# EAGLE design alt_signal_pins (EAGLE 5.11)
ABBREV: jn6; PROJECT: JeeNode v6
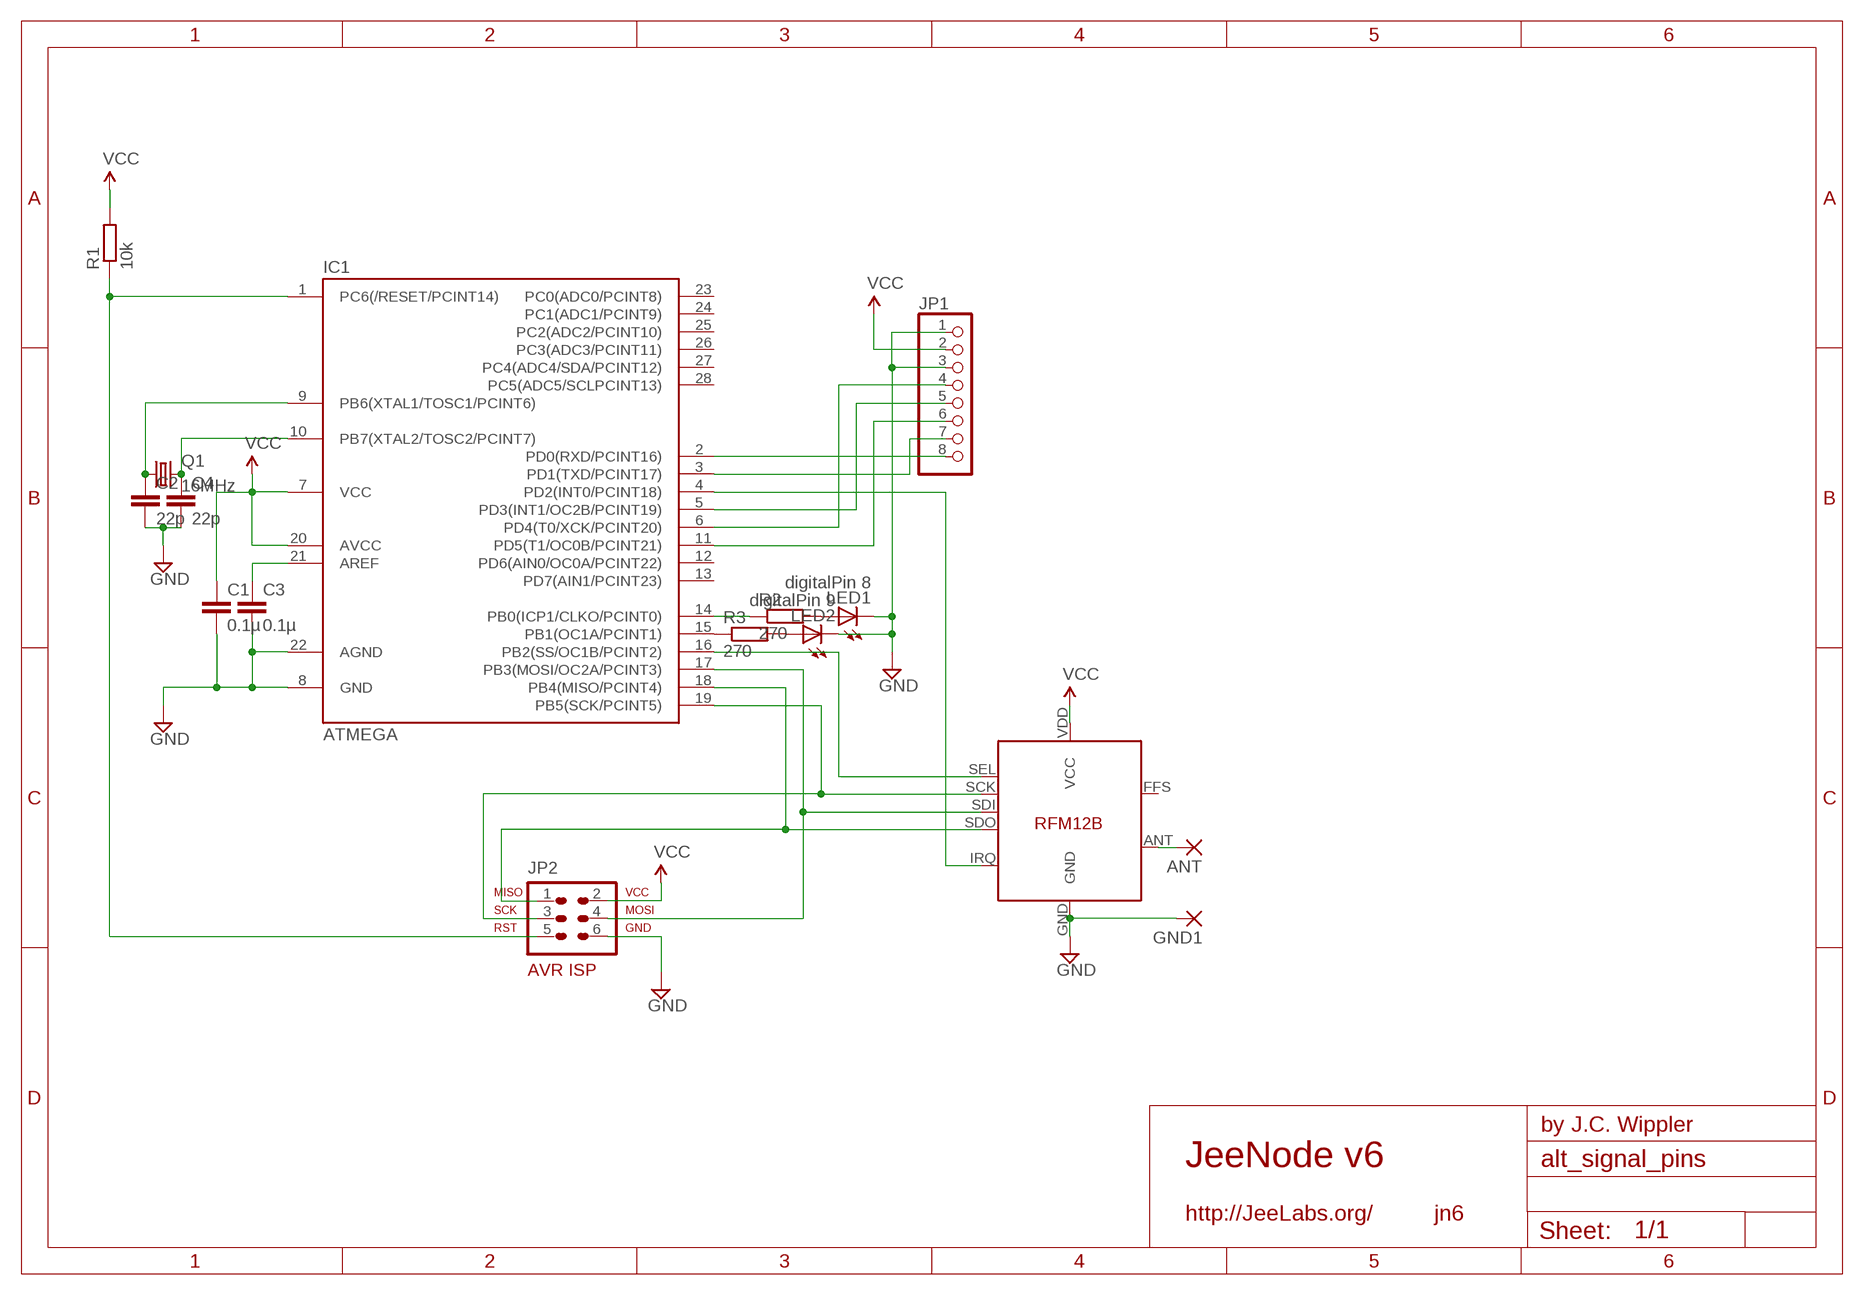
[diagram p0: schematic, sheet 1]

## Parts
ANT  1,6/0,8  [1,6/0,8]
C1  0.1µ  C-EU025-024X044  [C025-024X044]
C2  22p  C-EU025-024X044  [C025-024X044]
C3  0.1µ  C-EU025-024X044  [C025-024X044]
C4  22p  C-EU025-024X044  [C025-024X044]
GND1  1,6/0,8  [1,6/0,8]
IC1  ATMEGA  ATMEGA48/88/168-PU  [DIL28-3]
JP1  PINHD-1X8/90  [1X08/90]
JP2  AVR-ISP-6HORZ  [AVR-ISP-6R]
LED1  digitalPin 8  LED3MM  [LED3MM]
LED2  digitalPin 9  LED3MM  [LED3MM]
Q1  16MHz  CRYSTALHC49U70  [HC49U70]
R1  10k  R-EU_0204/7  [0204/7]
R2  270  R-EU_0204/7  [0204/7]
R3  270  R-EU_0204/7  [0204/7]
U$1  RFM12B  [RFM12B]

## Nets
GND [power]: C1.2 C2.2 C3.2 C4.2 GND1.1(P) IC1.8(GND) IC1.22(AGND) JP1.1 JP1.3 JP2.6 LED1.K(C) LED2.K(C) U$1.GND
INPUT1/PD0: IC1.2(PD0(RXD/PCINT16)) JP1.8
INPUT2/PD1: IC1.3(PD1(TXD/PCINT17)) JP1.7
INPUT3/PD3: IC1.5(PD3(INT1/OC2B/PCINT19)) JP1.5
INPUT4/PD4: IC1.6(PD4(T0/XCK/PCINT20)) JP1.4
INPUT5/PD5: IC1.11(PD5(T1/OC0B/PCINT21)) JP1.6
IRQ/PD2: IC1.4(PD2(INT0/PCINT18)) U$1.IRQ
MISO/PB4: IC1.18(PB4(MISO/PCINT4)) JP2.1 U$1.SDO
MOSI/PB3: IC1.17(PB3(MOSI/OC2A/PCINT3)) JP2.4 U$1.SDI
N$1: C2.1 IC1.9(PB6(XTAL1/TOSC1/PCINT6)) Q1.1
N$6: IC1.14(PB0(ICP1/CLKO/PCINT0)) R2.1
N$13: ANT.1(P) U$1.ANT
N$14: IC1.15(PB1(OC1A/PCINT1)) R3.1
N$15: LED1.A R2.2
N$16: LED2.A R3.2
N$19: C3.1 IC1.21(AREF)
N$21: C4.1 IC1.10(PB7(XTAL2/TOSC2/PCINT7)) Q1.2
RST: IC1.1(PC6(/RESET/PCINT14)) JP2.5 R1.1
SCK/PB5: IC1.19(PB5(SCK/PCINT5)) JP2.3 U$1.SCK
SEL/PB2: IC1.16(PB2(SS/OC1B/PCINT2)) U$1.SEL
VCC [power]: C1.1 IC1.7(VCC) IC1.20(AVCC) JP1.2 JP2.2 R1.2 U$1.VDD(VCC)
Unconnected: IC1.12(PD6(AIN0/OC0A/PCINT22)) IC1.13(PD7(AIN1/PCINT23)) IC1.23(PC0(ADC0/PCINT8)) IC1.24(PC1(ADC1/PCINT9)) IC1.25(PC2(ADC2/PCINT10)) IC1.26(PC3(ADC3/PCINT11)) IC1.27(PC4(ADC4/SDA/PCINT12)) IC1.28(PC5(ADC5/SCLPCINT13)) U$1.FFS

## Library data of the parts
ANT GND1 = JeeLabs:1,6/0,8: THROUGH-HOLE PAD
C1-C4 = resistor:C-EU: CAPACITOR, European symbol
IC1 = atmega8:ATMEGA48/88/168-PU
JP1 = pinhead:PINHD-1X8: PIN HEADER
JP2 = avr-7:AVR-ISP-6: AVR ISP-6 Serial Programming Header
LED1 LED2 = led:LED: LED OSRAM: - CHIPLED LG R971, LG N971, LY N971, LG Q971, LY Q971, LO R971, LY R971 LH N974, LH R974 LS Q976, LO Q976, LY Q976 LO Q996 - Hyper CHIPLED LW Q18S LB Q993, LB Q99A, LB R99A - SideLED LS A670, LO A670, LY A670, LG A670, LP A670 LB A673, LV A673, LT A673, LW A673 LH A674 LY A675 LS A676, LA A676, LO A676, LY A676, LW A676 LS A679, LY A679, LG A679 - Hyper Micro SIDELED® LS Y876, LA Y876, LO Y876, LY Y876 LT Y87S - SmartLED LW L88C, LW L88S LB L89C, LB L89S, LG L890 LS L89K, LO L89K, LY L89K LS L896, LA L896, LO L896, LY L896 - TOPLED LS T670, LO T670, LY T670, LG T670, LP T670 LSG T670, LSP T670, LSY T670, LOP T670, LYG T670 LG T671, LOG T671, LSG T671 LB T673, LV T673, LT T673, LW T673 LH T674 LS T676, LA T676, LO T676, LY T676, LB T676, LH T676, LSB T676, LW T676 LB T67C, LV T67C, LT T67C, LS T67K, LO T67K, LY T67K, LW E67C LS E67B, LA E67B, LO E67B, LY E67B, LB E67C, LV E67C, LT E67C LW T67C LS T679, LY T679, LG T679 LS T770, LO T770, LY T770, LG T770, LP T770 LB T773, LV T773, LT T773, LW T773 LH T774 LS E675, LA E675, LY E675, LS T675 LS T776, LA T776, LO T776, LY T776, LB T776 LHGB T686 LT T68C, LB T68C - Hyper Mini TOPLED® LB M676 - Mini TOPLED Santana® LG M470 LS M47K, LO M47K, LY M47K Source: http://www.osram.convergy.de LUXEON: - LUMILED® LXK2-PW12-R00, LXK2-PW12-S00, LXK2-PW14-U00, LXK2-PW14-V00 LXK2-PM12-R00, LXK2-PM12-S00, LXK2-PM14-U00 LXK2-PE12-Q00, LXK2-PE12-R00, LXK2-PE12-S00, LXK2-PE14-T00, LXK2-PE14-U00 LXK2-PB12-K00, LXK2-PB12-L00, LXK2-PB12-M00, LXK2-PB14-N00, LXK2-PB14-P00, LXK2-PB14-Q00 LXK2-PR12-L00, LXK2-PR12-M00, LXK2-PR14-Q00, LXK2-PR14-R00 LXK2-PD12-Q00, LXK2-PD12-R00, LXK2-PD12-S00 LXK2-PH12-R00, LXK2-PH12-S00 LXK2-PL12-P00, LXK2-PL12-Q00, LXK2-PL12-R00 Source: www.luxeon.com KINGBRIGHT: KA-3528ASYC Source: www.kingbright.com
Q1 = crystal:CRYSTAL: CRYSTAL; OC_FARNELL: unknown; OC_NEWARK: unknown
R1 = resistor:R-EU_: RESISTOR, European symbol
R2 R3 = rcl:R-EU_: RESISTOR, European symbol
U$1 = JeeLabs:RFM12B

## Net classes
1 power: width 0.381 mm, clearance 0.254 mm

## Board
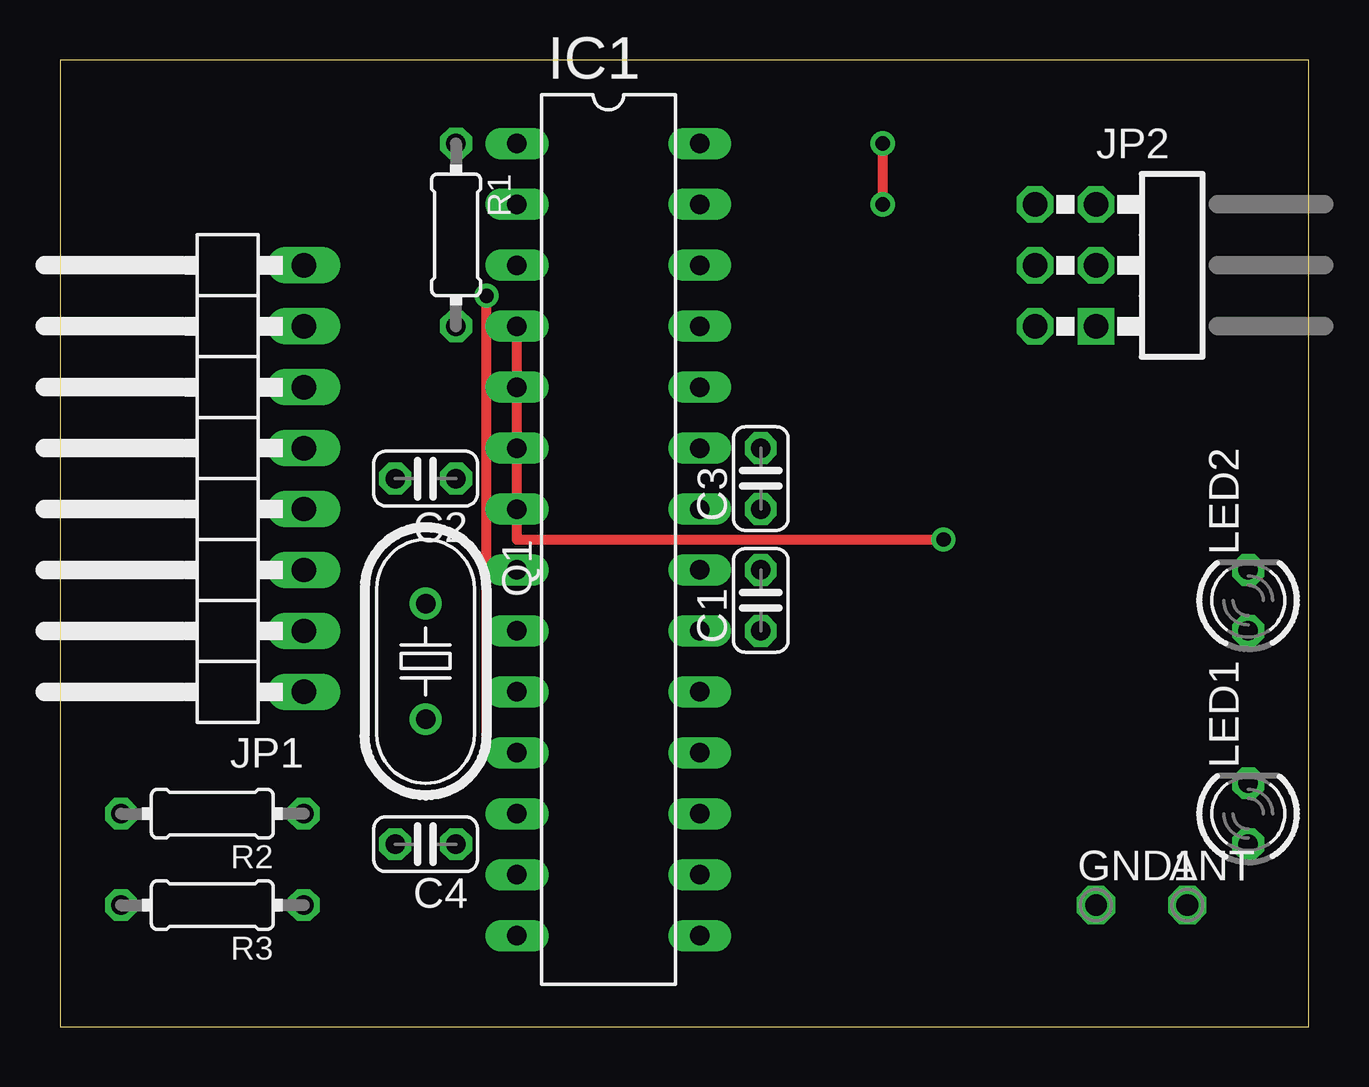
[diagram p1: board, top side]
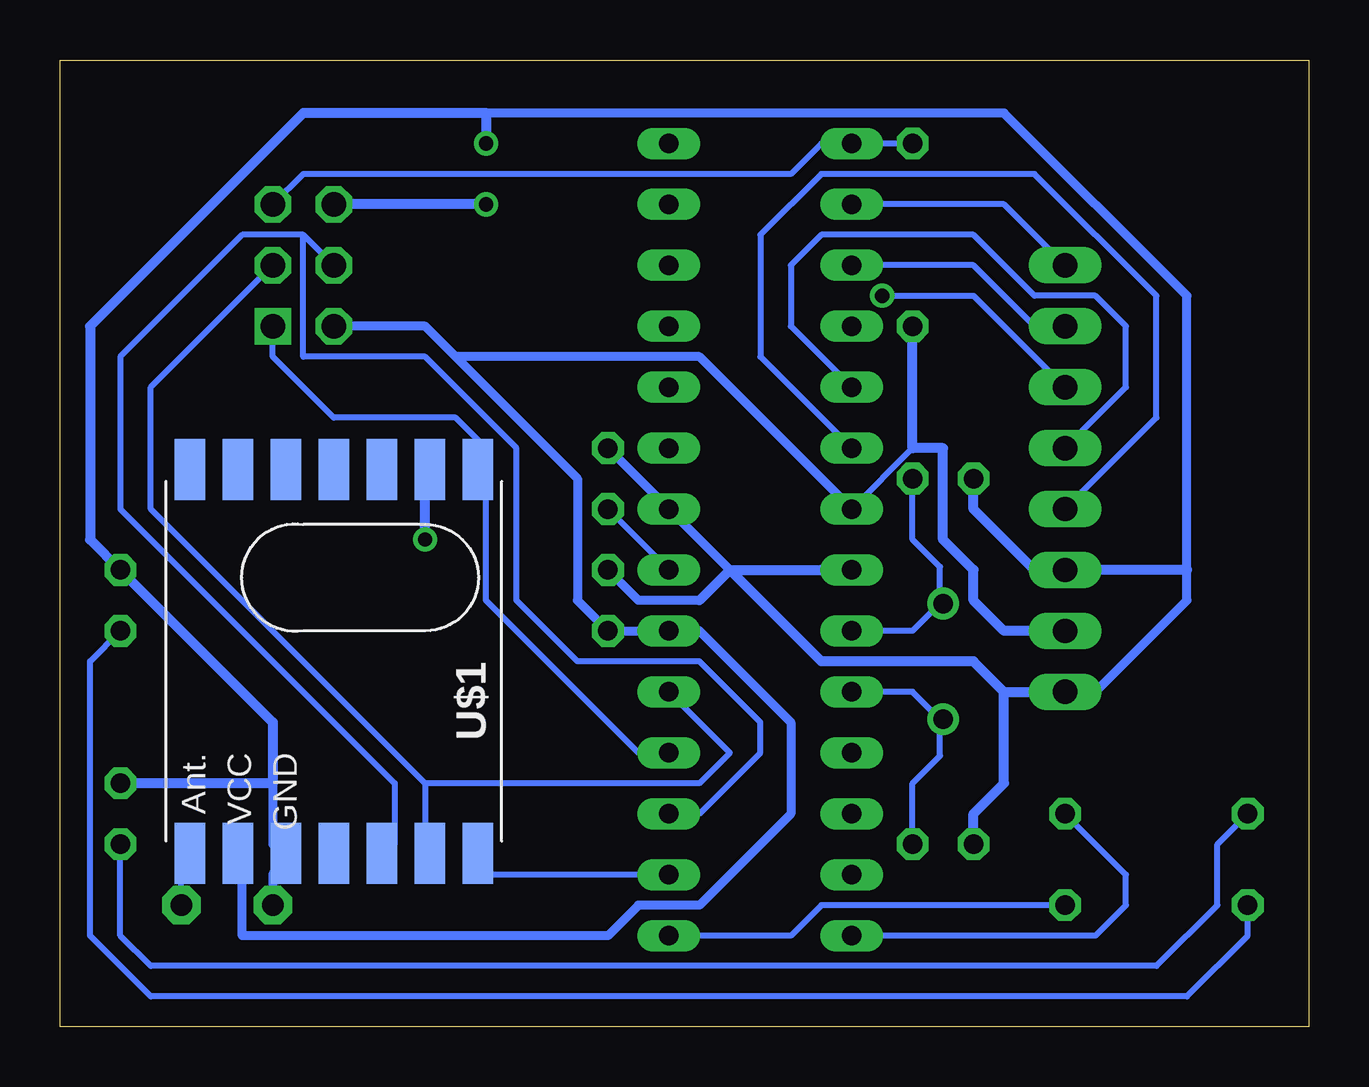
[diagram p2: board, bottom side, seen from below]

Size 52.05 x 40.31 mm. Coordinates in mm from the lower left corner, seen from the top.
Outline: 0,0 52.05,0 52.05,40.31 0,40.31 0,0
Copper layers (1*16): Top 0.035mm / dielectric 1.5mm / Bottom 0.035mm
Design rules "default": minimum track width 10mil, minimum drill 24mil, track to track 8mil, track to pad 8mil, pad to pad 8mil, via to via 8mil, smd to smd 8mil, copper to edge 40mil, drill to drill 8mil, minimum pad ring 10mil, minimum via ring 8mil, stop-mask expansion 4mil, vias tented up to drill 0mil, thermal gap 10mil

### Footprints (pad centres in the part's own frame; a part is rotated, then mirrored left to right if it is on the bottom)
1,6/0,8 = drill 0.9 pad 1.6 octagon: 1 0,0
C025-024X044 = drill 0.813 octagon: 1 -1.27,0; 2 1.27,0
DIL28-3 = drill 0.813 long: 1 -16.51,-3.81; 2 -13.97,-3.81; 3 -11.43,-3.81; 4 -8.89,-3.81; 5 -6.35,-3.81; 6 -3.81,-3.81; 7 -1.27,-3.81; 8 1.27,-3.81; 9 3.81,-3.81; 10 6.35,-3.81; 11 8.89,-3.81; 12 11.43,-3.81; 13 13.97,-3.81; 14 16.51,-3.81; 15 16.51,3.81; 16 13.97,3.81; 17 11.43,3.81; 18 8.89,3.81; 19 6.35,3.81; 20 3.81,3.81; 21 1.27,3.81; 22 -1.27,3.81; 23 -3.81,3.81; 24 -6.35,3.81; 25 -8.89,3.81; 26 -11.43,3.81; 27 -13.97,3.81; 28 -16.51,3.81
1X08/90 = drill 1.016 long: 1 -8.89,-3.81; 2 -6.35,-3.81; 3 -3.81,-3.81; 4 -1.27,-3.81; 5 1.27,-3.81; 6 3.81,-3.81; 7 6.35,-3.81; 8 8.89,-3.81
AVR-ISP-6R = drill 1.016 square: 1 -2.54,-1.27 | drill 1.016 octagon: 2 -2.54,1.27; 3 0,-1.27; 4 0,1.27; 5 2.54,-1.27; 6 2.54,1.27
LED3MM = drill 0.813 octagon: A -1.27,0; K 1.27,0
HC49U70 = drill 0.813 round: 1 -2.413,0; 2 2.413,0
0204/7 = drill 0.813 octagon: 1 -3.81,0; 2 3.81,0
RFM12B = smd 2.54 x 1.27: ANT 8,-6; FFS -8,2; GND 8,-2; IRQ -8,4; P$8 -8,0; P$9 -8,-2; P$10 -8,-4; P$12 -8,-6; P$16 8,0; SCK 8,4; SDI 8,2; SDO -8,6; SEL 8,6; VDD 8,-4

### Placement (x,y rotation side)
ANT  46.99,5.08 0 top
C1  29.21,17.78 90 top
C2  15.24,22.86 180 top
C3  29.21,22.86 90 top
C4  15.24,7.62 180 top
GND1  43.18,5.08 0 top
IC1  22.86,20.32 270 top
JP1  6.35,22.86 90 top
JP2  41.91,31.75 90 top
LED1  49.53,8.89 90 top
LED2  49.53,17.78 90 top
Q1  15.24,15.24 270 top
R1  16.51,33.02 270 top
R2  6.35,8.89 180 top
R3  6.35,5.08 180 top
U$1  40.64,15.24 270 bottom

### Tracks (layer width: path | path; a pad name or v marks a point on that pad's centre or on a via)
GND  (via drill 0.6)
  Top 0.406: v34.29,36.83 v34.29,34.29
  Bottom 0.381: 24.13,19.05 IC1.22 C3.2 | C1.2 27.94,17.78 25.4,17.78 | GND1.1 43.18,6.35 U$1.GND 43.18,7.62 43.18,10.16 | 8.89,13.97 5.08,17.78 5.08,19.05 5.08,30.48 12.7,38.1 34.29,38.1
  Bottom 0.406: LED1.K 43.18,10.16 43.18,12.7 LED2.K 50.8,20.32 50.8,29.21 41.91,38.1 34.29,38.1 v34.29,36.83 | 5.08,19.05 JP1.3 11.43,19.05 13.97,21.59 C2.2 | 8.89,13.97 JP1.1 12.7,13.97 | 20.32,19.05 IC1.8 24.13,19.05 | 12.7,13.97 13.97,15.24 20.32,15.24 24.13,19.05 | 24.13,19.05 25.4,17.78 | C4.2 13.97,8.89 12.7,10.16 12.7,13.97 | v34.29,34.29 JP2.6
INPUT1/PD0
  Bottom 0.254: IC1.2 12.7,34.29 JP1.8
INPUT2/PD1
  Bottom 0.254: IC1.3 13.97,31.75 11.43,29.21 JP1.7
INPUT3/PD3
  Bottom 0.254: IC1.5 21.59,29.21 21.59,31.75 20.32,33.02 13.97,33.02 11.43,30.48 8.89,30.48 7.62,29.21 7.62,26.67 JP1.5
INPUT4/PD4
  Bottom 0.254: IC1.6 22.86,27.94 22.86,33.02 20.32,35.56 11.43,35.56 6.35,30.48 6.35,25.4 JP1.4
INPUT5/PD5  (via drill 0.6)
  Top 0.406: IC1.11 17.78,11.43 v17.78,30.48
  Bottom 0.254: v17.78,30.48 13.97,30.48 JP1.6
IRQ/PD2  (via drill 0.6)
  Top 0.406: v36.83,20.32 19.05,20.32 IC1.4
  Bottom 0.406: U$1.IRQ 36.83,23.24 v36.83,20.32
MISO/PB4
  Bottom 0.254: IC1.18 27.94,11.43 34.29,17.78 34.29,22.86 U$1.SDO 34.29,24.13 35.56,25.4 40.64,25.4 43.18,27.94 JP2.1
MOSI/PB3
  Bottom 0.254: 41.91,33.02 44.45,33.02 49.53,27.94 49.53,21.59 38.1,10.16 38.1,7.62 U$1.SDI | 41.91,33.02 JP2.4 | IC1.17 25.4,8.89 22.86,11.43 22.86,12.7 25.4,15.24 30.48,15.24 33.02,17.78 33.02,24.13 36.83,27.94 41.91,27.94 41.91,33.02
N$1
  Bottom 0.254: IC1.9 16.51,16.51 15.37,17.65 | Q1.1 15.37,17.65 | 15.37,17.65 15.37,19.18 16.51,20.32 C2.1
N$6
  Bottom 0.254: R2.1 7.62,6.35 7.62,5.08 8.89,3.81 IC1.14
N$12  (via drill 0.6)
  other vias: 36.83,20.32
N$13
  Bottom 0.254: ANT.1 46.99,6.35 U$1.ANT
N$14
  Bottom 0.254: IC1.15 21.59,3.81 20.32,5.08 R3.1
N$15
  Bottom 0.254: LED1.A 49.53,3.81 48.26,2.54 6.35,2.54 3.81,5.08 3.81,7.62 R2.2
N$16
  Bottom 0.254: LED2.A 50.8,15.24 50.8,3.81 48.26,1.27 5.08,1.27 2.54,3.81 R3.2
N$19
  Bottom 0.254: IC1.21 C3.1
N$21
  Bottom 0.254: IC1.10 16.51,13.97 15.37,12.83 | 15.37,12.83 Q1.2 | 15.37,12.83 15.37,11.3 16.51,10.16 C4.1
RST
  Bottom 0.254: R1.1 IC1.1 20.32,36.83 21.59,35.56 41.91,35.56 JP2.5
SCK/PB5
  Bottom 0.254: 36.83,10.16 36.83,7.62 U$1.SCK | 36.83,10.16 48.26,21.59 48.26,26.67 JP2.3 | IC1.19 24.13,11.43 25.4,10.16 36.83,10.16
SEL/PB2
  Bottom 0.254: IC1.16 34.29,6.35 U$1.SEL
VCC
  Bottom 0.254: 16.51,24.13 IC1.7
  Bottom 0.381: U$1.VDD 44.45,6.35 44.45,3.81 29.21,3.81 27.94,5.08 25.4,5.08 21.59,8.89 21.59,12.7 25.4,16.51 IC1.20 C1.1 30.48,17.78 30.48,22.86 35.56,27.94 | JP2.2 36.83,29.21 35.56,27.94 | IC1.7 25.4,27.94 35.56,27.94
  Bottom 0.406: JP1.2 12.7,16.51 13.97,17.78 13.97,19.05 15.24,20.32 15.24,24.13 16.51,24.13 R1.2